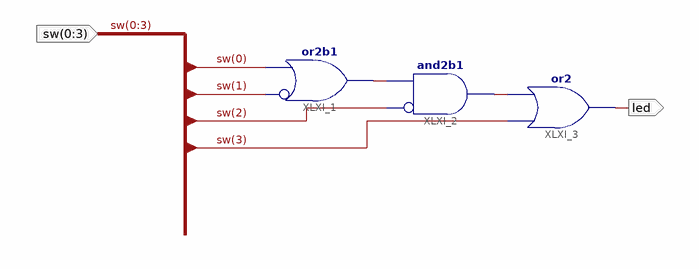
[diagram p0: schematic sheet 1]
// Xilinx ISE schematic scheme.sch (spartan6) as structural Verilog: 3 symbols, 2 ports
module scheme (
  input  [0:3] sw,
  output led
);

  wire XLXN_5, XLXN_7;

  or XLXI_1 (XLXN_5, ~sw[1], sw[0]);  // or2b1
  and XLXI_2 (XLXN_7, ~sw[2], XLXN_5);  // and2b1
  or XLXI_3 (led, sw[3], XLXN_7);
endmodule
